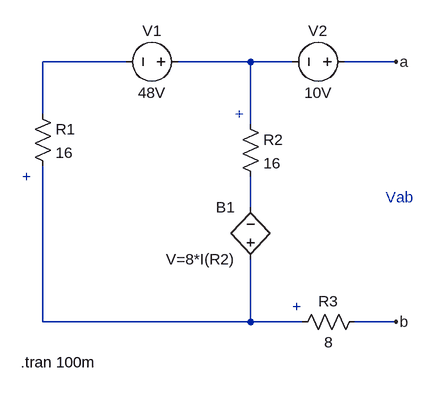
[diagram p0: schematic circuito.asc]
circuito.asc, the LTspice schematic file:
Version 4
SHEET 1 880 680
WIRE -112 -400 -240 -400
WIRE 80 -400 -32 -400
WIRE 144 -400 80 -400
WIRE 304 -400 224 -400
WIRE -240 -320 -240 -400
WIRE 80 -304 80 -400
WIRE 80 -176 80 -224
WIRE -240 0 -240 -240
WIRE 80 0 80 -96
WIRE 80 0 -240 0
WIRE 160 0 80 0
WIRE 304 0 240 0
FLAG 304 0 b
FLAG 304 -400 a
SYMBOL voltage -16 -400 R90
WINDOW 0 -32 56 VBottom 2
WINDOW 3 32 56 VTop 2
WINDOW 123 0 0 Left 2
WINDOW 39 0 0 Left 2
SYMATTR InstName V1
SYMATTR Value 48V
SYMBOL voltage 240 -400 R90
WINDOW 0 -32 56 VBottom 2
WINDOW 3 32 56 VTop 2
WINDOW 123 0 0 Left 2
WINDOW 39 0 0 Left 2
SYMATTR InstName V2
SYMATTR Value 10V
SYMBOL res -256 -336 R0
SYMATTR InstName R1
SYMATTR Value 16
SYMBOL res 64 -320 R0
SYMATTR InstName R2
SYMATTR Value 16
SYMBOL res 256 -16 R90
WINDOW 0 0 56 VBottom 2
WINDOW 3 32 56 VTop 2
SYMATTR InstName R3
SYMATTR Value 8
SYMBOL bv 80 -80 R180
WINDOW 0 24 96 Left 2
WINDOW 3 24 16 Left 2
SYMATTR InstName B1
SYMATTR Value V=8*I(R2)
TEXT 288 -192 Left 2 ;Vab
TEXT -272 -224 Left 2 ;+
TEXT 56 -320 Left 2 ;+
TEXT 144 -24 Left 2 ;+
TEXT -274 62 Left 2 !.tran 100m

The netlist it stands for:
* circuito.asc
V1 N002 N001 48V
V2 a N002 10V
R1 N001 N004 16
R2 N002 N003 16
R3 b N004 8
B1 N004 N003 V=8*I(R2)
* Vab
* +
* +
* +
.tran 100m
.backanno
.end